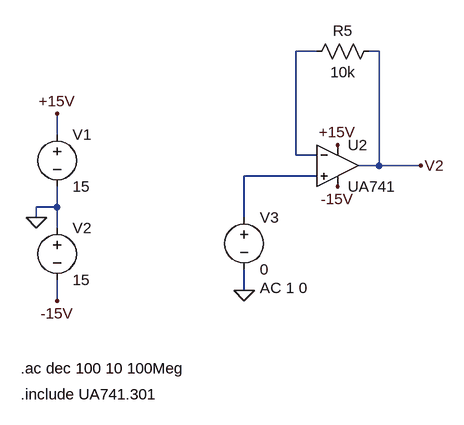
[diagram p0: schematic sim_ex2_g_10.asc]
sim_ex2_g_10.asc, the LTspice schematic file:
Version 4
SHEET 1 880 680
WIRE 144 -144 112 -144
WIRE 240 -144 224 -144
WIRE -256 -16 -256 -48
WIRE 112 16 112 -144
WIRE 144 16 112 16
WIRE 240 32 240 -144
WIRE 240 32 208 32
WIRE 304 32 240 32
WIRE 144 48 32 48
WIRE -256 96 -256 64
WIRE -256 96 -288 96
WIRE -288 112 -288 96
WIRE 32 112 32 48
WIRE -256 128 -256 96
WIRE 32 224 32 192
WIRE -256 240 -256 208
FLAG -288 112 0
FLAG -256 -48 +15V
FLAG -256 240 -15V
FLAG 176 0 +15V
FLAG 176 64 -15V
FLAG 32 224 0
FLAG 304 32 V2
SYMBOL voltage -256 -32 R0
WINDOW 123 0 0 Left 0
WINDOW 39 0 0 Left 0
SYMATTR InstName V1
SYMATTR Value 15
SYMBOL voltage -256 112 R0
WINDOW 123 0 0 Left 0
WINDOW 39 0 0 Left 0
SYMATTR InstName V2
SYMATTR Value 15
SYMBOL res 240 -160 R90
WINDOW 0 0 56 VBottom 2
WINDOW 3 32 56 VTop 2
SYMATTR InstName R5
SYMATTR Value 10k
SYMBOL voltage 32 96 R0
WINDOW 123 24 124 Left 2
WINDOW 39 0 0 Left 0
SYMATTR Value2 AC 1 0
SYMATTR InstName V3
SYMATTR Value 0
SYMBOL OpAmps\\opamp2 176 -32 R0
SYMATTR InstName U2
SYMATTR Value UA741
TEXT -312 344 Left 2 !.ac dec 100 10 100Meg
TEXT -312 384 Left 2 !.include UA741.301

The netlist it stands for:
* sim_ex2_g_10.asc
V1 +15V 0 15
V2 0 -15V 15
R5 V2 N001 10k
V3 N002 0 0 AC 1 0
XU2 N002 N001 +15V -15V V2 UA741  ; pins In+ In- V+ V- OUT
.ac dec 100 10 100Meg
.include UA741.301
.backanno
.end